# Altium project 数粒机接收板2通道.PrjPCB
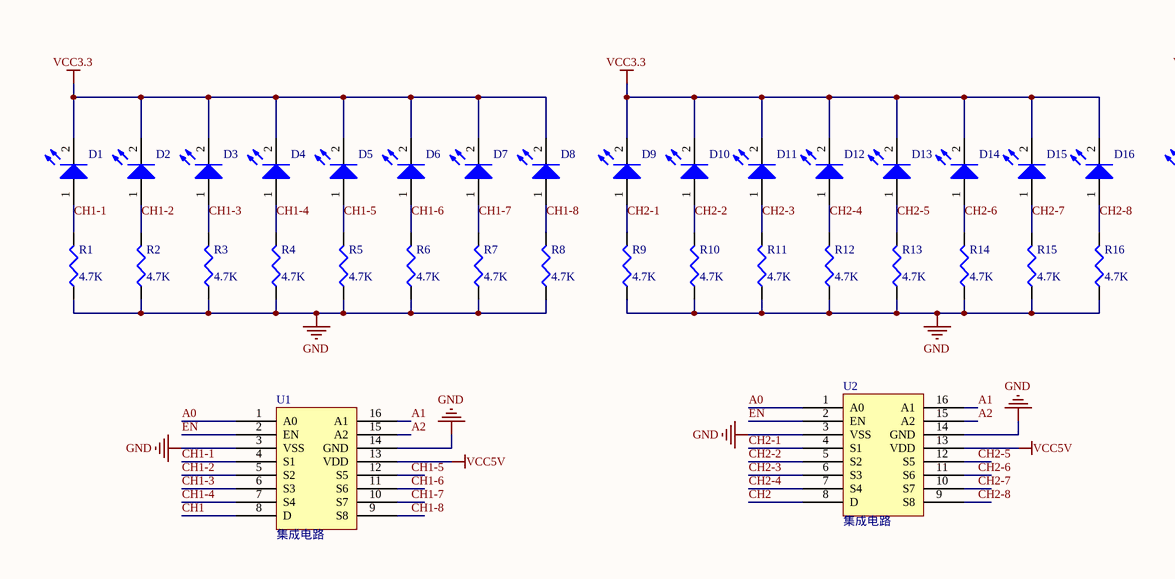
[diagram p0: 数粒机接收板2通道.SchDoc, left]
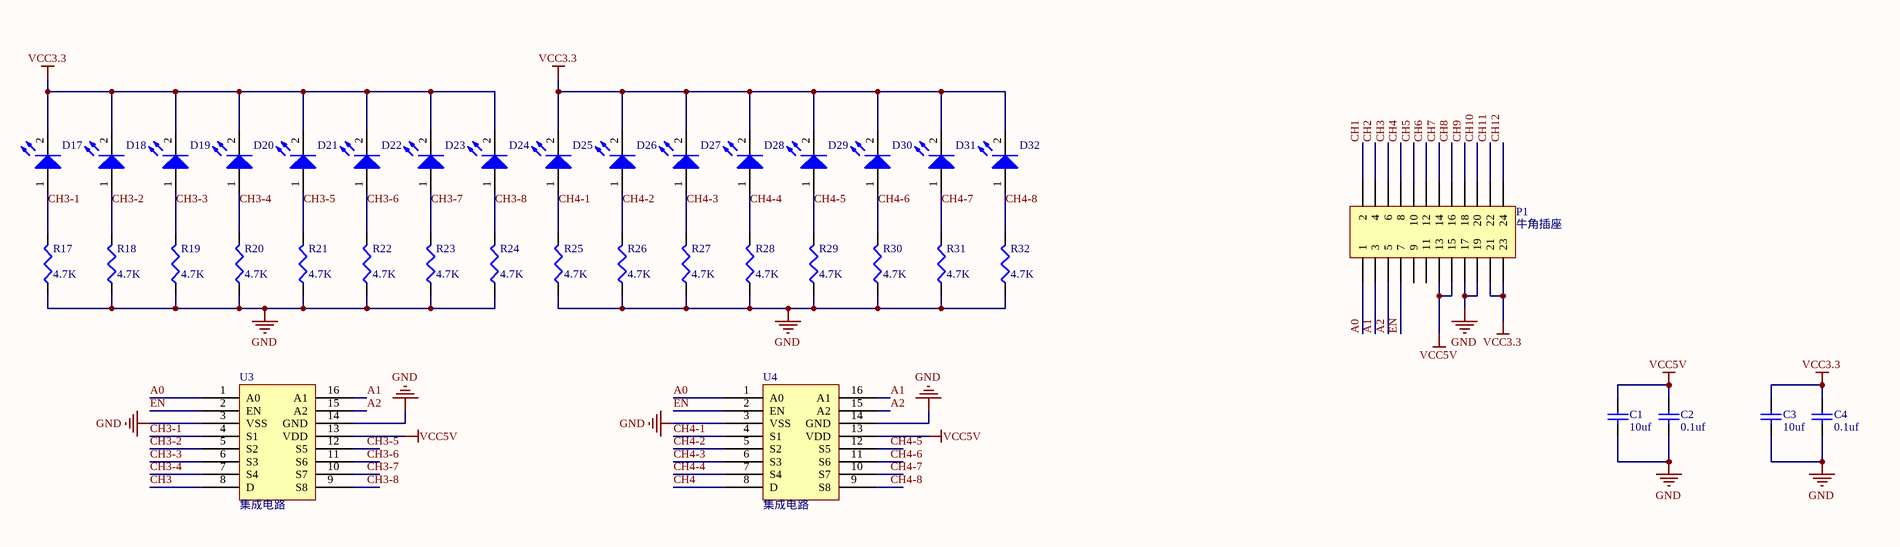
[diagram p1: 数粒机接收板2通道.SchDoc, right]
1 sheet, 73 parts. Net scope: global (net labels, ports and power ports of the same name join across sheets).
Board file: 数粒机接收板2通道.PcbDoc

## Sheet 数粒机接收板2通道.SchDoc
size A1

### Parts
C1  value 10uf  [0805c]  (hidden comment: 贴片电容 10uf)
C2  value 0.1uf  [0805c]  (hidden comment: 贴片电容 0.1uf)
C3  value 10uf  [0805c]  (hidden comment: 贴片电容 10uf)
C4  value 0.1uf  [0805c]  (hidden comment: 贴片电容 0.1uf)
D1  红外接收珠子  [jieshou1206]  (value not drawn)
D2  红外接收珠子  [jieshou1206]  (value not drawn)
D3  红外接收珠子  [jieshou1206]  (value not drawn)
D4  红外接收珠子  [jieshou1206]  (value not drawn)
D5  红外接收珠子  [jieshou1206]  (value not drawn)
D6  红外接收珠子  [jieshou1206]  (value not drawn)
D7  红外接收珠子  [jieshou1206]  (value not drawn)
D8  红外接收珠子  [jieshou1206]  (value not drawn)
D9  红外接收珠子  [jieshou1206]  (value not drawn)
D10  红外接收珠子  [jieshou1206]  (value not drawn)
D11  红外接收珠子  [jieshou1206]  (value not drawn)
D12  红外接收珠子  [jieshou1206]  (value not drawn)
D13  红外接收珠子  [jieshou1206]  (value not drawn)
D14  红外接收珠子  [jieshou1206]  (value not drawn)
D15  红外接收珠子  [jieshou1206]  (value not drawn)
D16  红外接收珠子  [jieshou1206]  (value not drawn)
D17  红外接收珠子  [jieshou1206]  (value not drawn)
D18  红外接收珠子  [jieshou1206]  (value not drawn)
D19  红外接收珠子  [jieshou1206]  (value not drawn)
D20  红外接收珠子  [jieshou1206]  (value not drawn)
D21  红外接收珠子  [jieshou1206]  (value not drawn)
D22  红外接收珠子  [jieshou1206]  (value not drawn)
D23  红外接收珠子  [jieshou1206]  (value not drawn)
D24  红外接收珠子  [jieshou1206]  (value not drawn)
D25  红外接收珠子  [jieshou1206]  (value not drawn)
D26  红外接收珠子  [jieshou1206]  (value not drawn)
D27  红外接收珠子  [jieshou1206]  (value not drawn)
D28  红外接收珠子  [jieshou1206]  (value not drawn)
D29  红外接收珠子  [jieshou1206]  (value not drawn)
D30  红外接收珠子  [jieshou1206]  (value not drawn)
D31  红外接收珠子  [jieshou1206]  (value not drawn)
D32  红外接收珠子  [jieshou1206]  (value not drawn)
P1  牛角插座  [HDR2X12]
R1  value 4.7K  [0805r]  (hidden comment: 贴片电阻)
R2  value 4.7K  [0805r]  (hidden comment: 贴片电阻)
R3  value 4.7K  [0805r]  (hidden comment: 贴片电阻)
R4  value 4.7K  [0805r]  (hidden comment: 贴片电阻)
R5  value 4.7K  [0805r]  (hidden comment: 贴片电阻)
R6  value 4.7K  [0805r]  (hidden comment: 贴片电阻)
R7  value 4.7K  [0805r]  (hidden comment: 贴片电阻)
R8  value 4.7K  [0805r]  (hidden comment: 贴片电阻)
R9  value 4.7K  [0805r]  (hidden comment: 贴片电阻)
R10  value 4.7K  [0805r]  (hidden comment: 贴片电阻)
R11  value 4.7K  [0805r]  (hidden comment: 贴片电阻)
R12  value 4.7K  [0805r]  (hidden comment: 贴片电阻)
R13  value 4.7K  [0805r]  (hidden comment: 贴片电阻)
R14  value 4.7K  [0805r]  (hidden comment: 贴片电阻)
R15  value 4.7K  [0805r]  (hidden comment: 贴片电阻)
R16  value 4.7K  [0805r]  (hidden comment: 贴片电阻)
R17  value 4.7K  [0805r]  (hidden comment: 贴片电阻)
R18  value 4.7K  [0805r]  (hidden comment: 贴片电阻)
R19  value 4.7K  [0805r]  (hidden comment: 贴片电阻)
R20  value 4.7K  [0805r]  (hidden comment: 贴片电阻)
R21  value 4.7K  [0805r]  (hidden comment: 贴片电阻)
R22  value 4.7K  [0805r]  (hidden comment: 贴片电阻)
R23  value 4.7K  [0805r]  (hidden comment: 贴片电阻)
R24  value 4.7K  [0805r]  (hidden comment: 贴片电阻)
R25  value 4.7K  [0805r]  (hidden comment: 贴片电阻)
R26  value 4.7K  [0805r]  (hidden comment: 贴片电阻)
R27  value 4.7K  [0805r]  (hidden comment: 贴片电阻)
R28  value 4.7K  [0805r]  (hidden comment: 贴片电阻)
R29  value 4.7K  [0805r]  (hidden comment: 贴片电阻)
R30  value 4.7K  [0805r]  (hidden comment: 贴片电阻)
R31  value 4.7K  [0805r]  (hidden comment: 贴片电阻)
R32  value 4.7K  [0805r]  (hidden comment: 贴片电阻)
U1  集成电路  [TSSOP16]
U2  集成电路  [TSSOP16]
U3  集成电路  [TSSOP16]
U4  集成电路  [TSSOP16]

### Nets
GND: C1.1 C2.1 C3.1 C4.1 P1.17 P1.19 R1.1 R2.1 R3.1 R4.1 R5.1 R6.1 R7.1 R8.1 R9.1 R10.1 R11.1 R12.1 R13.1 R14.1 R15.1 R16.1 R17.1 R18.1 R19.1 R20.1 R21.1 R22.1 R23.1 R24.1 R25.1 R26.1 R27.1 R28.1 R29.1 R30.1 R31.1 R32.1 U1.3(VSS) U1.14(GND) U2.3(VSS) U2.14(GND) U3.3(VSS) U3.14(GND) U4.3(VSS) U4.14(GND)
VCC3.3: C3.2 C4.2 D1.2(K) D2.2(K) D3.2(K) D4.2(K) D5.2(K) D6.2(K) D7.2(K) D8.2(K) D9.2(K) D10.2(K) D11.2(K) D12.2(K) D13.2(K) D14.2(K) D15.2(K) D16.2(K) D17.2(K) D18.2(K) D19.2(K) D20.2(K) D21.2(K) D22.2(K) D23.2(K) D24.2(K) D25.2(K) D26.2(K) D27.2(K) D28.2(K) D29.2(K) D30.2(K) D31.2(K) D32.2(K) P1.21 P1.23
VCC5V: C1.2 C2.2 P1.13 P1.15 U1.13(VDD) U2.13(VDD) U3.13(VDD) U4.13(VDD)
A0: P1.1 U1.1(A0) U2.1(A0) U3.1(A0) U4.1(A0)
A1: P1.3 U1.16(A1) U2.16(A1) U3.16(A1) U4.16(A1)
A2: P1.5 U1.15(A2) U2.15(A2) U3.15(A2) U4.15(A2)
CH1: P1.2 U1.8(D)
CH1-1: D1.1(A) R1.2 U1.4(S1)
CH1-2: D2.1(A) R2.2 U1.5(S2)
CH1-3: D3.1(A) R3.2 U1.6(S3)
CH1-4: D4.1(A) R4.2 U1.7(S4)
CH1-5: D5.1(A) R5.2 U1.12(S5)
CH1-6: D6.1(A) R6.2 U1.11(S6)
CH1-7: D7.1(A) R7.2 U1.10(S7)
CH1-8: D8.1(A) R8.2 U1.9(S8)
CH2: P1.4 U2.8(D)
CH2-1: D9.1(A) R9.2 U2.4(S1)
CH2-2: D10.1(A) R10.2 U2.5(S2)
CH2-3: D11.1(A) R11.2 U2.6(S3)
CH2-4: D12.1(A) R12.2 U2.7(S4)
CH2-5: D13.1(A) R13.2 U2.12(S5)
CH2-6: D14.1(A) R14.2 U2.11(S6)
CH2-7: D15.1(A) R15.2 U2.10(S7)
CH2-8: D16.1(A) R16.2 U2.9(S8)
CH3: P1.6 U3.8(D)
CH3-1: D17.1(A) R17.2 U3.4(S1)
CH3-2: D18.1(A) R18.2 U3.5(S2)
CH3-3: D19.1(A) R19.2 U3.6(S3)
CH3-4: D20.1(A) R20.2 U3.7(S4)
CH3-5: D21.1(A) R21.2 U3.12(S5)
CH3-6: D22.1(A) R22.2 U3.11(S6)
CH3-7: D23.1(A) R23.2 U3.10(S7)
CH3-8: D24.1(A) R24.2 U3.9(S8)
CH4: P1.8 U4.8(D)
CH4-1: D25.1(A) R25.2 U4.4(S1)
CH4-2: D26.1(A) R26.2 U4.5(S2)
CH4-3: D27.1(A) R27.2 U4.6(S3)
CH4-4: D28.1(A) R28.2 U4.7(S4)
CH4-5: D29.1(A) R29.2 U4.12(S5)
CH4-6: D30.1(A) R30.2 U4.11(S6)
CH4-7: D31.1(A) R31.2 U4.10(S7)
CH4-8: D32.1(A) R32.2 U4.9(S8)
CH5: P1.10
CH6: P1.12
CH7: P1.14
CH8: P1.16
CH9: P1.18
CH10: P1.20
CH11: P1.22
CH12: P1.24
EN: P1.7 U1.2(EN) U2.2(EN) U3.2(EN) U4.2(EN)

Not connected (* = marked no-connect by the designer): P1 9 11

### Library data of the parts
C1 C3 = Cap: Capacitor 10uf; Published: 8-Jun-2000; LatestRevisionDate: 17-Jul-2002; LatestRevisionNote: Re-released for DXP Platform.; PackageReference: RAD-0.3; Publisher: Altium Limited
C2 C4 = Cap: Capacitor 0.1uf; Published: 8-Jun-2000; LatestRevisionDate: 17-Jul-2002; LatestRevisionNote: Re-released for DXP Platform.; PackageReference: RAD-0.3; Publisher: Altium Limited
D1-D32 = LED0: PD15-21B/TR8; Published: 8-Jun-2000; LatestRevisionDate: 08-Jul-2005; LatestRevisionNote: Mech Layer 1 removed.; PackageReference: LED-0; Publisher: Altium Limited
P1 = Header 12X2: Header, 12-Pin, Dual row; LatestRevisionDate: 17-Jul-2002; LatestRevisionNote: Re-released for DXP Platform.; Publisher: Altium Limited
R1-R32 = Res3: 电阻; Published: 8-Jun-2000; LatestRevisionDate: 29-May-2009; LatestRevisionNote: IPC-7351 Footprint Added.; PackageReference: J1-0603; Publisher: Altium Limited; PackageDescription: Chip Resistor
U1-U4 = ADG708: ADG708BRU-REEL